# Altium schematic sheet Altimeter.SchDoc
size A; SheetNumber: 2; SheetTotal: 8
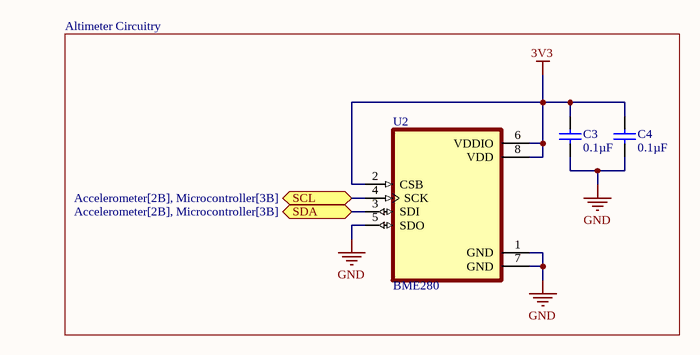
[diagram p0: Altimeter.SchDoc]

## Parts
C3  0.1µF  [CAPC3216X100X50LL20T25]
C4  0.1µF  [CAPC3216X100X50LL20T25]
U2  BME280  [PSON65P250X250X100-8N]

## Blocks framed on the sheet
Altimeter Circuitry: C3 C4 U2

## Ports
SCL (bidir, see Accelerometer[2B], Microcontroller[3B]), SDA (bidir, see Accelerometer[2B], Microcontroller[3B])

## Nets
3V3: C3.1 C4.1 U2.2(CSB) U2.6(VDDIO) U2.8(VDD)
GND: C3.2 C4.2 U2.1(GND) U2.5(SDO) U2.7(GND)
SCL: U2.4(SCK) ; port SCL
SDA: U2.3(SDI) ; port SDA

## Library data of the parts
C3 C4 = CMP-1664-00001-4: Chip Capacitor, 100 nF, +/- 10%, 25 V, -55 to 125 degC, 1206 (3216 Metric), RoHS, Tape and Reel; Manufacturer: Kemet; Voltage Rating: 25 V; ComponentLink1URL: http://www.kemet.com/; Max Operating Temperature: 125 degC; PackageReference: 1206; ComponentLink2URL: http://www.kemet.com/docfinder?Partnumber=C1206F104K3RACTU; ComponentLink1Description: Manufacturer URL; ComponentLink2Description: Datasheet; Length: 3.2 mm; Packaging: Tape and Reel; Height: 0.78 mm; Mounting Technology: Surface Mount; REACH SVHC: No SVHC; PackageDescription: 2-Pin Surface Mount Device, Body 3.2 x 1.6 mm; Min Operating Temperature: -55 degC; RoHSCompliant: true; DatasheetVersion: 02/2016; Package Quantity: 4000
U2 = BME280: DIGITAL HUMIDITY, PRESSURE AND TEMPERATURE SENSOR<br>* Digital interface IÂ²C (up to 3.4 MHz) and SPI (3 and 4 wire, up to 10 MHz)* Supply voltage VDD main supply voltage range: 1.71 V to 3.6 V*VDDIO interface voltage range: 1.2 V to 3.6 V<br> Operating range -40â€¦+85 Â°C, 0â€¦100 % rel. humidity, 300â€¦1100 hPa <br><br>  The library has been designed by<a href="https://www.facebook.com/groups/eaglecadsoftUK"> Richard Magdycz</a>; Package: None; Availability: Unavailable; MP: BME280; Value: *; Price: None